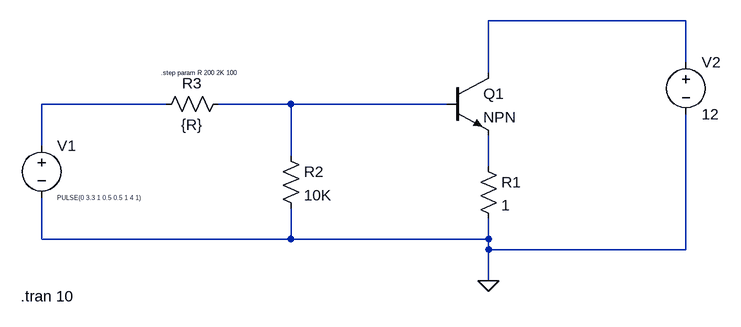
[diagram p0: schematic bjt_analysis.asc]
bjt_analysis.asc, the LTspice schematic file:
Version 4
SHEET 1 1180 680
WIRE 560 64 256 64
WIRE 560 128 560 64
WIRE 256 144 256 64
WIRE -240 192 -432 192
WIRE -48 192 -160 192
WIRE 192 192 -48 192
WIRE -432 256 -432 192
WIRE -48 272 -48 192
WIRE 256 288 256 240
WIRE -432 400 -432 336
WIRE -48 400 -48 352
WIRE -48 400 -432 400
WIRE 256 400 256 368
WIRE 256 400 -48 400
WIRE 256 416 256 400
WIRE 560 416 560 208
WIRE 560 416 256 416
WIRE 256 464 256 416
FLAG 256 464 0
SYMBOL npn 192 144 R0
SYMATTR InstName Q1
SYMBOL res 240 272 R0
SYMATTR InstName R1
SYMATTR Value 1
SYMATTR SpiceLine tol=1 pwr=0.1
SYMBOL res -64 256 R0
SYMATTR InstName R2
SYMATTR Value 10K
SYMBOL res -144 176 R90
WINDOW 0 0 56 VBottom 2
WINDOW 3 32 56 VTop 2
SYMATTR InstName R3
SYMATTR Value {R}
SYMBOL voltage -432 240 R0
WINDOW 3 24 96 Left 0
WINDOW 123 0 0 Left 0
WINDOW 39 0 0 Left 0
SYMATTR Value PULSE(0 3.3 1 0.5 0.5 1 4 1)
SYMATTR InstName V1
SYMBOL voltage 560 112 R0
WINDOW 123 0 0 Left 0
WINDOW 39 0 0 Left 0
SYMATTR InstName V2
SYMATTR Value 12
TEXT -464 488 Left 2 !.tran 10
TEXT -248 144 Left 0 !.step param R 200 2K 100

The netlist it stands for:
* bjt_analysis.asc
Q1 N001 N003 N004 0 NPN
R1 N004 0 1 tol=1 pwr=0.1
R2 N003 0 10K
R3 N003 N002 {R}
V1 N002 0 PULSE(0 3.3 1 0.5 0.5 1 4 1)
V2 N001 0 12
.model NPN NPN
.model PNP PNP
.lib standard.bjt
.tran 10
.step param R 200 2K 100
.backanno
.end